# EAGLE schematic rgb (EAGLE 7.2.0)
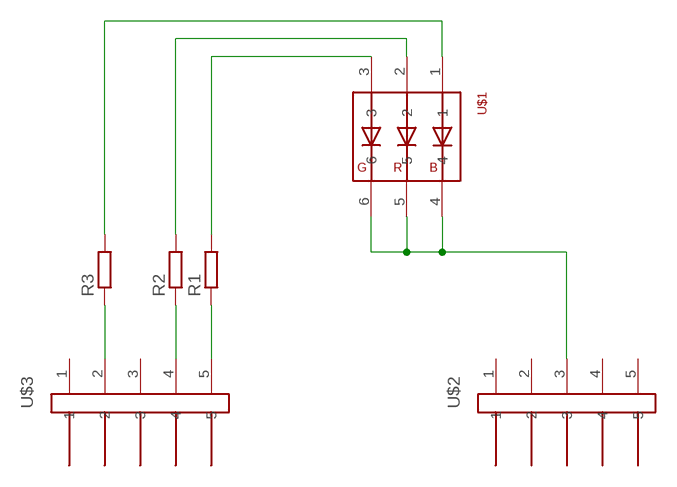
[diagram p0: schematic, sheet 1]

## Parts
R1  R-EU_R0603  [R0603]
R2  R-EU_R0603  [R0603]
R3  R-EU_R0603  [R0603]
U$1  RGB_WW-FCE50TC-Q1  [RGB_WW-FCE50TC-Q1]
U$2  JUMPER5M  [JUMPER5M]
U$3  JUMPER5M  [JUMPER5M]

## Nets
GND: U$1.4 U$1.5 U$1.6 U$2.3
N$1: R3.1 U$3.2
N$2: R1.2 U$1.3
N$3: R2.2 U$1.2
N$4: R3.2 U$1.1
N$5: R2.1 U$3.4
N$6: R1.1 U$3.5
Unconnected: U$2.1 U$2.2 U$2.4 U$2.5 U$3.1 U$3.3

## Library data of the parts
R1-R3 = resistor:R-EU_: RESISTOR, European symbol
U$1 = !stavebnice03:RGB_WW-FCE50TC-Q1
U$2 U$3 = !stavebnice03:JUMPER5M

## Net classes
0 default: clearance 0.205 mm